# EAGLE design cnc rev 1 (EAGLE 7.2.0)
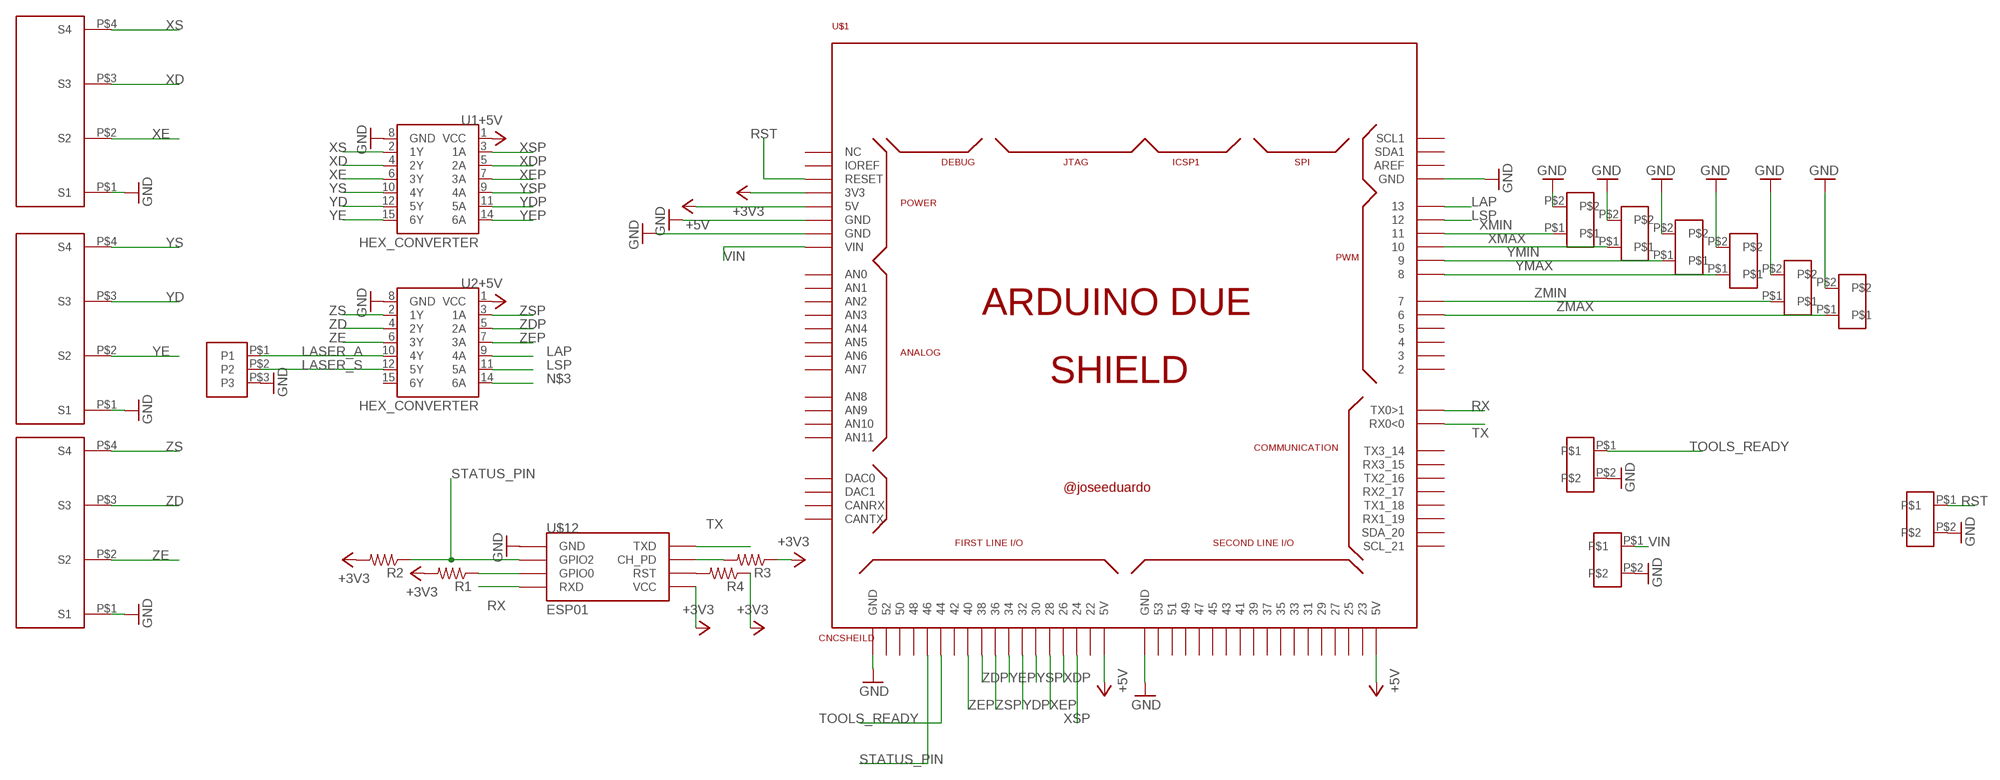
[diagram p0: schematic, sheet 1]

## Parts
INPUT  PIN_LOCK_1X2  [PIN_LOCK1X2]
INPUT1  PIN_LOCK_1X2  [PIN_LOCK1X2]
R1  0.1OHM-1/2W-1%(1210)  [1210]
R2  0.1OHM-1/2W-1%(1210)  [1210]
R3  0.1OHM-1/2W-1%(1210)  [1210]
R4  0.1OHM-1/2W-1%(1210)  [1210]
U1  HEX_CONVERTER  [SO016]
U2  HEX_CONVERTER  [SO016]
U$1  CNCSHEILD  [CNCSHEILD]
U$2  TBC1X4  [PTC1X4]
U$3  TBC1X4  [PTC1X4]
U$4  TBC1X4  [PTC1X4]
U$5  PIN_LOCK_1X2  [PIN_LOCK1X2]
U$6  PIN_LOCK_1X2  [PIN_LOCK1X2]
U$7  PIN_LOCK_1X2  [PIN_LOCK1X2]
U$8  PIN_LOCK_1X2  [PIN_LOCK1X2]
U$9  PIN_LOCK_1X2  [PIN_LOCK1X2]
U$10  PIN_LOCK_1X2  [PIN_LOCK1X2]
U$11  PIN_LOCK_1X2  [PIN_LOCK1X2]
U$12  ESP01  [ESP01]
U$13  PIN_LOCK_1X3  [PIN_LOCK1X3]

## Nets
+3V3: R1.2 R2.2 R3.1 R4.1 U$1.3V3 U$12.VCC
+5V: U1.1(VCC) U2.1(VCC) U$1.5V0(5V) U$1.5V0_1(5V) U$1.5V0_2(5V)
GND: INPUT1.P$2 INPUT.P$2 U$1.GND U$1.GND_1(GND) U$1.GND_2(GND) U$1.GND_3(GND) U$1.GND_4(GND) U$2.P$1(S1) U$3.P$1(S1) U$4.P$1(S1) U$5.P$2 U$6.P$2 U$7.P$2 U$8.P$2 U$9.P$2 U$10.P$2 U$11.P$2
LAP: U2.9(4A) U$1.13
LASER_A: U2.10(4Y) U$13.P$1(P1)
LASER_S: U2.12(5Y) U$13.P$2(P2)
LSP: U2.11(5A) U$1.12
N$3: U2.14(6A)
N$5: R1.1 U$12.GPIO0
N$6: R3.2 U$12.CH_PD
N$7: R4.2 U$12.RST
RST: U$1.RESET U$11.P$1
RX: U$1.1(TX0>1) U$12.RX(RXD)
STATUS_PIN: R2.1 U$1.46 U$12.GPIO2
TOOLS_READY: INPUT1.P$1 U$1.44
TX: U$1.0(RX0<0) U$12.TX(TXD)
VIN: INPUT.P$1 U$1.VIN
XD: U1.4(2Y) U$4.P$3(S3)
XDP: U1.5(2A) U$1.26
XE: U1.6(3Y) U$4.P$2(S2)
XEP: U1.7(3A) U$1.28
XMAX: U$1.10 U$8.P$1
XMIN: U$1.11 U$5.P$1
XS: U1.2(1Y) U$4.P$4(S4)
XSP: U1.3(1A) U$1.24
YD: U1.12(5Y) U$2.P$3(S3)
YDP: U1.11(5A) U$1.32
YE: U1.15(6Y) U$2.P$2(S2)
YEP: U1.14(6A) U$1.34
YMAX: U$1.8 U$9.P$1
YMIN: U$1.9 U$6.P$1
YS: U1.10(4Y) U$2.P$4(S4)
YSP: U1.9(4A) U$1.30
ZD: U2.4(2Y) U$3.P$3(S3)
ZDP: U2.5(2A) U$1.38
ZE: U2.6(3Y) U$3.P$2(S2)
ZEP: U2.7(3A) U$1.40
ZMAX: U$1.6 U$10.P$1
ZMIN: U$1.7 U$7.P$1
ZS: U2.2(1Y) U$3.P$4(S4)
ZSP: U2.3(1A) U$1.36
Unconnected: U1.8(GND) U2.8(GND) U2.15(6Y) U$1.2 U$1.3 U$1.4 U$1.5 U$1.14(TX3_14) U$1.15(RX3_15) U$1.16(TX2_16) U$1.17(RX2_17) U$1.18(TX1_18) U$1.19(RX1_19) U$1.20(SDA_20) U$1.21(SCL_21) U$1.22 U$1.23 U$1.25 U$1.27 U$1.29 U$1.31 U$1.33 U$1.35 U$1.37 U$1.39 U$1.41 U$1.42 U$1.43 U$1.45 U$1.47 U$1.48 U$1.49 U$1.50 U$1.51 U$1.52 U$1.53 U$1.A0(AN0) U$1.A1(AN1) U$1.A2(AN2) U$1.A3(AN3) U$1.A4(AN4) U$1.A5(AN5) U$1.A6(AN6) U$1.A7(AN7) U$1.A8(AN8) U$1.A9(AN9) U$1.A10(AN10) U$1.A11(AN11) U$1.AREF U$1.CANRX U$1.CANTX U$1.DAC0 U$1.DAC1 U$1.IOREF U$1.NC_2(NC) U$1.SCL1 U$1.SDA1 U$12.GND U$13.P$3(P3)

## Library data of the parts
INPUT INPUT1 U$5-U$11 = ARDUINO_MODULE:PIN_LOCK_1X2
R1-R4 = SparkFun-Resistors:0.1OHM-1/2W-1%(1210); PROD_ID: RES-12374
U1 U2 = SparkFun-DigitalIC:HEX_CONVERTER: 74HC4050 Hex Buffer Level Shifter SMD SO016; PROD_ID: IC-09604
U$1 = arduino_due_shield:CNCSHEILD
U$2-U$4 = ARDUINO_MODULE:TBC1X4
U$12 = esp8266modules:ESP01: ESP8266 Wifi module 01
U$13 = ARDUINO_MODULE:PIN_LOCK_1X3

## Board
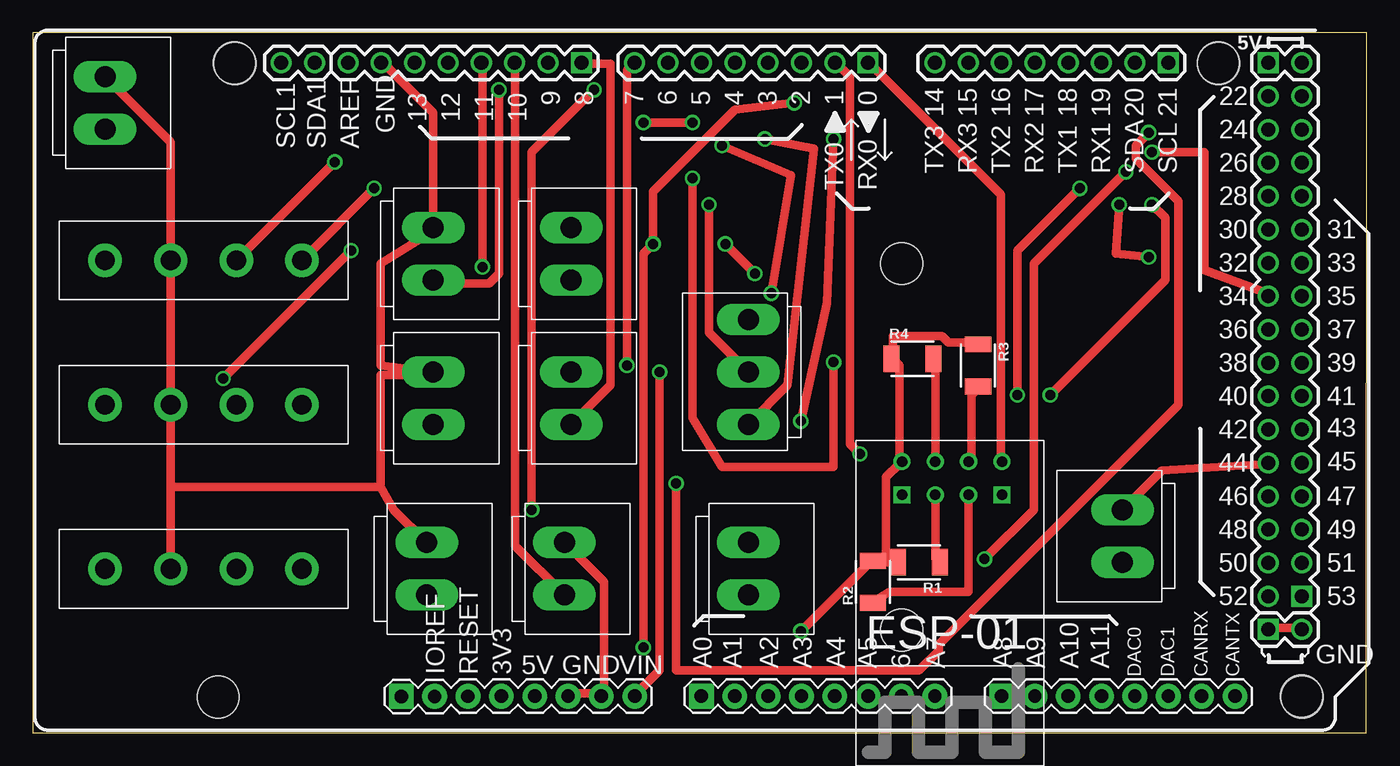
[diagram p1: board, top side]
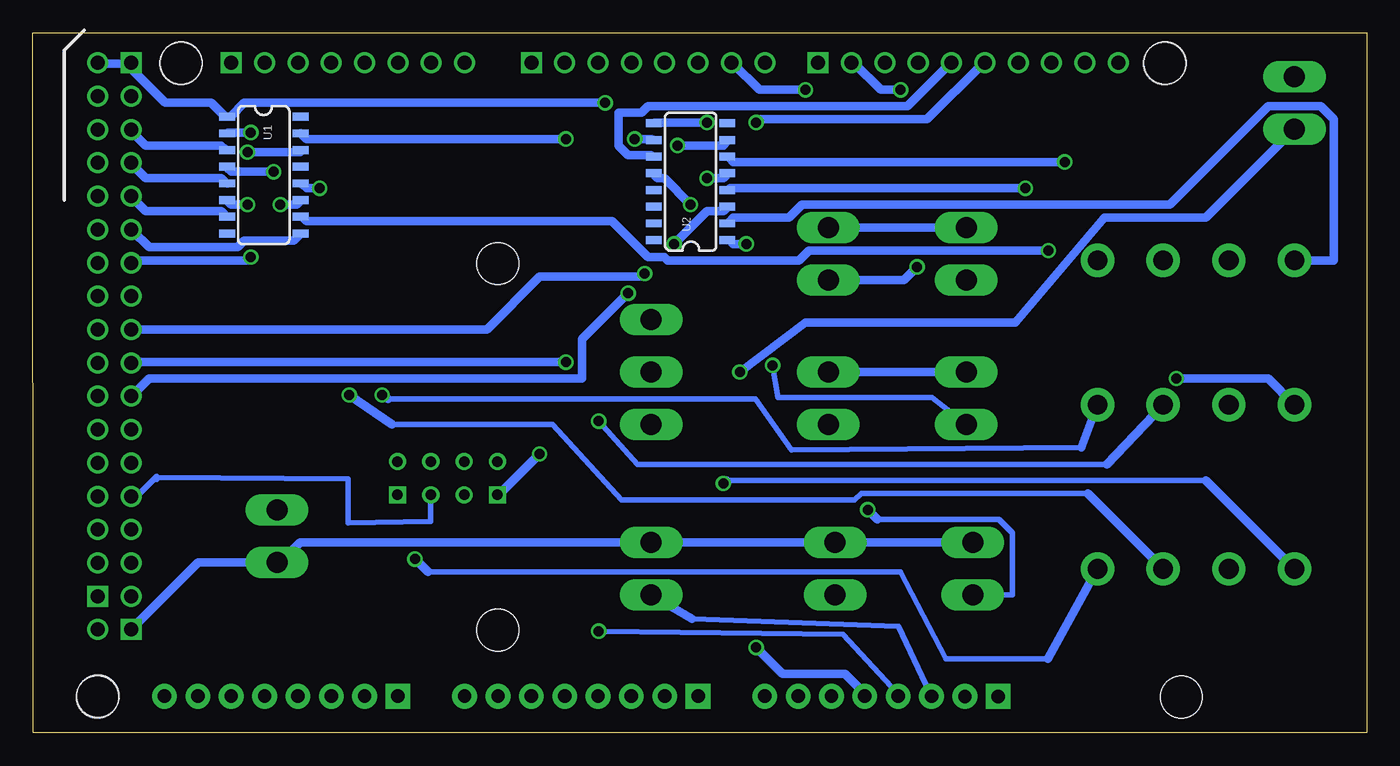
[diagram p2: board, bottom side, seen from below]

Size 101.6 x 53.34 mm. Coordinates in mm from the lower left corner, seen from the top.
Outline: 0,0 101.58,0 101.6,53.34 0,53.34 0,0
Copper layers (1*16): Top 0.035mm / dielectric 1.5mm / Bottom 0.035mm
Design rules "default *": minimum track width 25mil, minimum drill 30mil, track to track 8mil, track to pad 8mil, pad to pad 8mil, via to via 8mil, smd to smd 8mil, copper to edge 40mil, drill to drill 8mil, minimum pad ring 10mil, minimum via ring 8mil, stop-mask expansion 4mil, vias tented up to drill 0mil, thermal gap 10mil

### Footprints (pad centres in the part's own frame; a part is rotated, then mirrored left to right if it is on the bottom)
PIN_LOCK1X2 = drill 1.6 long: P$1 -2,0; P$2 2,0
1210 = smd 1.2 x 2: 1 -1.6,0; 2 1.6,0
SO016 = smd 0.6 x 1.2: 1 -4.445,-2.8; 2 -3.175,-2.8; 3 -1.905,-2.8; 4 -0.635,-2.8; 5 0.635,-2.8; 6 1.905,-2.8; 7 3.175,-2.8; 8 4.445,-2.8; 9 4.445,2.8; 10 3.175,2.8; 11 1.905,2.8; 12 0.635,2.8; 13 -0.635,2.8; 14 -1.905,2.8; 15 -3.175,2.8; 16 -4.445,2.8
CNCSHEILD = drill 1.067 square: 0 13.843,25.146; 5V0_1 44.323,25.146; 8 -8.001,25.146; 21 36.703,25.146; 53 46.863,-15.494; GND_2 44.323,-18.034 | drill 1.067: 1 11.303,25.146; 2 8.763,25.146; 3 6.223,25.146; 4 3.683,25.146; 5 1.143,25.146; 5V0_2 46.863,25.146; 6 -1.397,25.146; 7 -3.937,25.146; 9 -10.541,25.146; 10 -13.081,25.146; 11 -15.621,25.146; 12 -18.161,25.146; 13 -20.701,25.146; 14 18.923,25.146; 15 21.463,25.146; 16 24.003,25.146; 17 26.543,25.146; 18 29.083,25.146; 19 31.623,25.146; 20 34.163,25.146; 22 44.323,22.606; 23 46.863,22.606; 24 44.323,20.066; 25 46.863,20.066; 26 44.323,17.526; 27 46.863,17.526; 28 44.323,14.986; 29 46.863,14.986; 30 44.323,12.446; 31 46.863,12.446; 32 44.323,9.906; 33 46.863,9.906; 34 44.323,7.366; 35 46.863,7.366; 36 44.323,4.826; 37 46.863,4.826; 38 44.323,2.286; 39 46.863,2.286; 40 44.323,-0.254; 41 46.863,-0.254; 42 44.323,-2.794; 43 46.863,-2.794; 44 44.323,-5.334; 45 46.863,-5.334; 46 44.323,-7.874; 47 46.863,-7.874; 48 44.323,-10.414; 49 46.863,-10.414; 50 44.323,-12.954; 51 46.863,-12.954; 52 44.323,-15.494; AREF -25.781,25.146; GND_3 46.863,-18.034; GND_4 -23.241,25.146; SCL1 -30.861,25.146; SDA1 -28.321,25.146 | drill 1.016 pad 1.88: 3V3 -14.097,-23.114; 5V0 -11.557,-23.114; A1 3.683,-23.114; A2 6.223,-23.114; A3 8.763,-23.114; A4 11.303,-23.114; A5 13.843,-23.114; A6 16.383,-23.114; A7 18.923,-23.114; A9 26.543,-23.114; A10 29.083,-23.114; A11 31.623,-23.114; CANRX 39.243,-23.114; CANTX 41.783,-23.114; DAC0 34.163,-23.114; DAC1 36.703,-23.114; GND -9.017,-23.114; GND_1 -6.477,-23.114; IOREF -19.184,-23.127; RESET -16.637,-23.115; VIN -3.937,-23.114 | drill 1.016 pad 1.88 square: A0 1.143,-23.114; A8 24.003,-23.114; NC_2 -21.724,-23.127 | hole 3.2: -34.417,25.146; 40.513,25.146; 46.863,-23.114; 46.888,-23.165; -34.392,25.095; 40.538,25.095; -35.662,-23.165; 16.408,9.855; 16.408,-18.085
PTC1X4 = drill 1.5 pad 2.54: P$1 -2.5,0; P$2 2.5,0; P$3 7.5,0; P$4 -7.5,0
ESP01 = drill 0.8: CH_PD -1.285,-8.178; GPIO0 1.255,-5.638; GPIO2 -1.285,-5.638; RST 1.255,-8.178; TX -3.825,-8.178; VCC 3.795,-8.178 | drill 0.8 square: GND -3.825,-5.638; RX 3.795,-5.638
PIN_LOCK1X3 = drill 1.6 long: P$1 4,0; P$2 0,0; P$3 -4,0

### Placement (x,y rotation side)
INPUT  5.5,48 90 top
INPUT1  83,15 270 top
R1  67.5,13 180 top
R2  64,11.5 90 top
R3  72,28 270 top
R4  67,28.5 0 top
U1  84,42.5 270 bottom
U2  51.5,42 90 bottom
U$1  49.78,25.91 0 top
U$2  13,25 0 top
U$3  13,36 0 top
U$4  13,12.5 0 top
U$5  41,36.5 90 top
U$6  30.5,36.5 90 top
U$7  30.5,25.5 90 top
U$8  40.5,12.5 90 top
U$9  41,25.5 90 top
U$10  30,12.5 90 top
U$11  54.5,12.5 90 top
U$12  70,12.5 180 top
U$13  54.5,27.5 270 top

### Tracks (layer width: path | path; a pad name or v marks a point on that pad's centre or on a via)
+3V3  (via drill 0.76)
  Top 0.635: R1.2 65,13 | 65,13 64,13 R2.2 63.75,13 v58.5,7.75 | R3.1 72,29.75 69.75,29.75 69.25,30.25 65.5,30.25 65.5,28.75 R4.1 65.5,28.5 66,28 66,20.75 U$12.VCC 66,20.5 65,19.5 65,13
  Bottom 0.406: 35.75,3 39.9,7.5 v58.5,7.75
  Bottom 0.635: 35.75,3 U$1.3V3
+5V  (via drill 0.76)
  Top 0.635: v46.5,6.5 46.5,36.5 v47.25,37.25 47.25,41.25 53.5,47.5 v58,48
  Bottom 0.635: 94.38,50.88 94.5,51 96.5,51 U$1.5V0_2 | 94.38,50.88 91.5,48 88,48 87,47 U1.1 86.5,47 85.5,48 v58,48 | U$1.5V0_1 94.25,51 94.38,50.88 | v47.25,37.25 48.25,37.25 48.5,37.5 U2.1 | v46.5,6.5 44.5,4.5 39.75,4.5 38.25,3 U$1.5V0
GND
  Top 0.635: 10.5,18.75 U$2.P$1 U$3.P$1 10.5,45 INPUT.P$2 | 10.5,18.75 U$4.P$1 | U$1.GND_4 26.75,51 30.5,47.25 U$6.P$2 30.5,38.25 26.5,35.75 26.5,28 U$7.P$2 30.5,27.25 26.5,27.25 26.5,18.75 | U$1.GND_2 94.25,8 96.5,8 U$1.GND_3 | U$1.GND 41,3 43.25,3 U$1.GND_1 43.25,3.25 43.5,3.5 43.5,11.5 U$8.P$2 | 26.5,18.75 27.5,17 U$10.P$2 | 26.5,18.75 10.5,18.75
  Bottom 0.635: U$9.P$2 U$7.P$2 | U$6.P$2 U$5.P$2 | U$1.GND_2 94,8 89,13 INPUT1.P$2 82.75,13 81.25,14.5 U$11.P$2 U$8.P$2 U$10.P$2
LAP  (via drill 0.76)
  Top 0.635: v46.5,46.5 v50.25,46.5
  Bottom 0.635: v50.25,46.5 54.25,46.5 U2.9 | v46.5,46.5 46.25,46.75 33.5,46.75 29.25,51 U$1.13
LASER_A  (via drill 0.76)
  Top 0.635: v55.75,45.25 59.5,44.5 57.5,26.5 U$13.P$1
  Bottom 0.635: v55.75,45.25 54.5,45.25 U2.10
LASER_S  (via drill 0.76)
  Top 0.635: v51.5,40.25 51.5,30.5 U$13.P$2
  Bottom 0.635: v51.5,40.25 53.5,42.25 54,42.25 54.25,42.5 U2.12
LSP
  Bottom 0.635: U2.11 54.5,44 56.25,44 57,44.75 57,47.25 55.25,47.25 54.75,47.75 35,47.75 31.75,51 U$1.12
N$5
  Top 0.635: R1.1 69,13 68.75,13.25 68.75,18 U$12.GPIO0
N$6
  Top 0.635: R3.2 72,26.25 71.5,25.75 71.5,20.75 U$12.CH_PD
N$7
  Top 0.635: R4.2 68.75,28.5 68.75,20.75 U$12.RST
RST
  Bottom 0.406: 33.25,3 35.65,8.1 51.4,8.7
  Bottom 0.635: U$11.P$1 51.4,8.7 | 33.25,3 U$1.RESET
RX  (via drill 0.76)
  Top 0.635: v63,21.25 62.25,22 62.25,50 61.25,51 U$1.1
  Bottom 0.635: v63,21.25 66,18.25 U$12.RX
STATUS_PIN
  Top 0.635: R2.1 64,10 65.25,10.75 71.25,10.75 71.25,18 U$12.GPIO2
  Bottom 0.406: 71.5,18.25 71.3,18.25 71.3,16.1 77.6,16 77.6,19.35 92.15,19.45 | 92.15,19.45 92.15,19.55 93.45,18.25 94,18.25 | 92.15,19.45 92.15,19.3
  Bottom 0.635: 94,18.25 U$1.46 | 71.5,18.25 U$12.GPIO2
TOOLS_READY
  Top 0.635: INPUT1.P$1 86,20 94,20.5 U$1.44
TX
  Top 0.635: U$12.TX 73.75,20.75 73.75,41 63.75,51 U$1.0
VIN  (via drill 0.76)
  Top 0.635: v47.75,27.5 47.75,4.75 46,3 U$1.VIN
  Bottom 0.635: v47.75,27.5 42.75,31.25 26.75,31.25 20,39.25 12.25,39.25 INPUT.P$1
XD  (via drill 0.76)
  Top 0.635: v83.25,42.75 76.25,35.75 76.25,17 v72.5,13.25
  Bottom 0.406: 71.5,12.25 35.5,12.25 32.05,5.65 24.3,5.65
  Bottom 0.635: v83.25,42.75 86.5,42.75 86.75,43 U1.4 | 71.5,12.25 v72.5,13.25 | U$4.P$3 24.3,5.65
XDP
  Bottom 0.635: U1.5 87,42 87.25,42.25 93,42.25 94,43.25 U$1.26
XE  (via drill 0.76)
  Top 0.635: v85.25,40.25 86.25,39.25 86.25,34.5 v77.5,25.75
  Bottom 0.406: 74.25,23.5 62,23.5 56.75,17.75 39,17.75 38.5,18.25 21.25,18.25
  Bottom 0.635: v85.25,40.25 86.5,40.25 86.75,40.5 U1.6 | 74.25,23.5 v77.5,25.75 | U$4.P$2 21.25,18.25
XEP
  Bottom 0.635: U1.7 87,39.5 87.25,39.75 93,39.75 94,40.75 U$1.28
XMAX
  Top 0.635: U$8.P$1 36.75,14.25 36.75,51 U$1.10
XMIN  (via drill 0.76)
  Top 0.635: v34.25,35.5 34.25,51 U$1.11
  Bottom 0.635: v34.25,35.5 35.25,34.5 U$5.P$1
XS  (via drill 0.76)
  Top 0.635: v85,45.75 84,44.75 84,43.75 87.25,40.5 87.25,25 69,6.75 69,6.25 67.5,4.75 49,4.75 v49,19
  Bottom 0.406: 12.25,19.25 48.75,19.25
  Bottom 0.635: v85,45.75 86.75,45.75 U1.2 | 48.75,19.25 v49,19 | U$4.P$4 12.25,19.25
XSP
  Bottom 0.635: U1.3 87,44.5 87.25,44.75 93,44.75 94,45.75 U$1.24
YD  (via drill 0.76)
  Top 0.635: v79.75,41.5 75,36.75 v75,25.75
  Bottom 0.406: 74.55,25.45 46.55,25.45 43.8,21.55 21.75,21.75
  Bottom 0.635: v79.75,41.5 80.75,41.5 81,41.75 U1.12 | 74.55,25.45 v75,25.75 | U$2.P$3 21.75,21.75
YDP  (via drill 0.76)
  Top 0.635: v82.75,40.25 82.5,36.5 v85,36.25
  Bottom 0.635: v82.75,40.25 81.5,40.25 81.25,40.5 U1.11 | v85,36.25 85.25,36 94,36 U$1.32
YE  (via drill 0.76)
  Top 0.635: v61,45.25 60.5,32.75 v58.5,23.75
  Bottom 0.406: v58.5,23.75 55.55,20.45 19.8,20.45
  Bottom 0.635: v61,45.25 80.75,45.25 81,45.5 U1.15 | U$2.P$2 19.8,20.45
YEP  (via drill 0.76)
  Top 0.635: v85.25,44.25 89.25,44.25 89.25,35.25 94,33.5 U$1.34
  Bottom 0.635: v85.25,44.25 81.25,44.25 U1.14
YMAX
  Top 0.635: U$9.P$1 44,26.5 44,51 42,51 U$1.8
YMIN  (via drill 0.76)
  Top 0.635: v35.5,49 35.5,35 34.75,34.25 30.5,34.25 U$6.P$1
  Bottom 0.635: v35.5,49 37,49 39,51 U$1.9
YS  (via drill 0.76)
  Top 0.635: v14.5,27 v24.25,36.75
  Bottom 0.635: v24.25,36.75 42.5,36.75 43.25,36 53.25,36 53.5,36.25 54.75,36.25 57.5,39 80.75,39 81,39.25 U1.10 | v14.5,27 7.5,27 U$2.P$4
YSP
  Bottom 0.635: U1.9 81.25,38 81.75,37.5 85.5,37.5 86,37 92.75,37 94,38.25 U$1.30
ZD  (via drill 0.76)
  Top 0.635: U$3.P$3 v26,41.5
  Bottom 0.635: v26,41.5 48.5,41.5 U2.4
ZDP  (via drill 0.76)
  Top 0.635: v50.25,42.25 50.25,24 52.5,20.25 61,20.25 v61,28.25
  Bottom 0.635: v50.25,42.25 49,42.25 48.75,42.5 U2.5 | v61,28.25 94,28.25 U$1.38
ZE  (via drill 0.76)
  Top 0.635: U$3.P$2 v23,43.5
  Bottom 0.635: v23,43.5 48.25,43.5 48.5,43.75 U2.6
ZEP  (via drill 0.76)
  Top 0.635: v52.5,44.75 57.75,42.5 v56.25,33.5
  Bottom 0.635: v52.5,44.75 49,44.75 48.75,45 U2.7 | v56.25,33.5 59.75,30 59.75,27 92.75,27 94,25.75 U$1.40
ZMAX  (via drill 0.76)
  Top 0.635: v42.75,49 38,44.25 v38,17
  Bottom 0.406: 37.25,16.25 28,16.25 27,15.25 27,10.5 U$10.P$1
  Bottom 0.635: v42.75,49 46.25,49 48.25,51 U$1.6 | 37.25,16.25 v38,17
ZMIN  (via drill 0.76)
  Top 0.635: v45.25,28 45.25,50.5 45.75,51 U$1.7
  Bottom 0.406: v45.25,28 44.85,25.55 33.1,25.55 U$7.P$1
ZS
  Bottom 0.635: U$3.P$4 2.5,36 2.5,46.75 3.5,47.75 7.5,47.75 15,40.25 43,40.25 44,39.25 48.25,39.25 48.5,39 U2.2
ZSP  (via drill 0.76)
  Top 0.635: v55,35 v52.75,37.25
  Bottom 0.635: v52.75,37.25 50.25,39.75 49,39.75 48.75,40 U2.3 | v55,35 55.25,34.75 63,34.75 67,30.75 94,30.75 U$1.36